# Altium schematic sheet 01.Template.Title.SchDoc
size 209 x 297 mm; Author: Мурашкин Д.В.; DocumentNumber: _D01.R1; SheetNumber: 1; SheetTotal: 2; Scale: 1:1; Letter1Column: Э; PartName: модуль; DocumentsNumber: _D01.R1
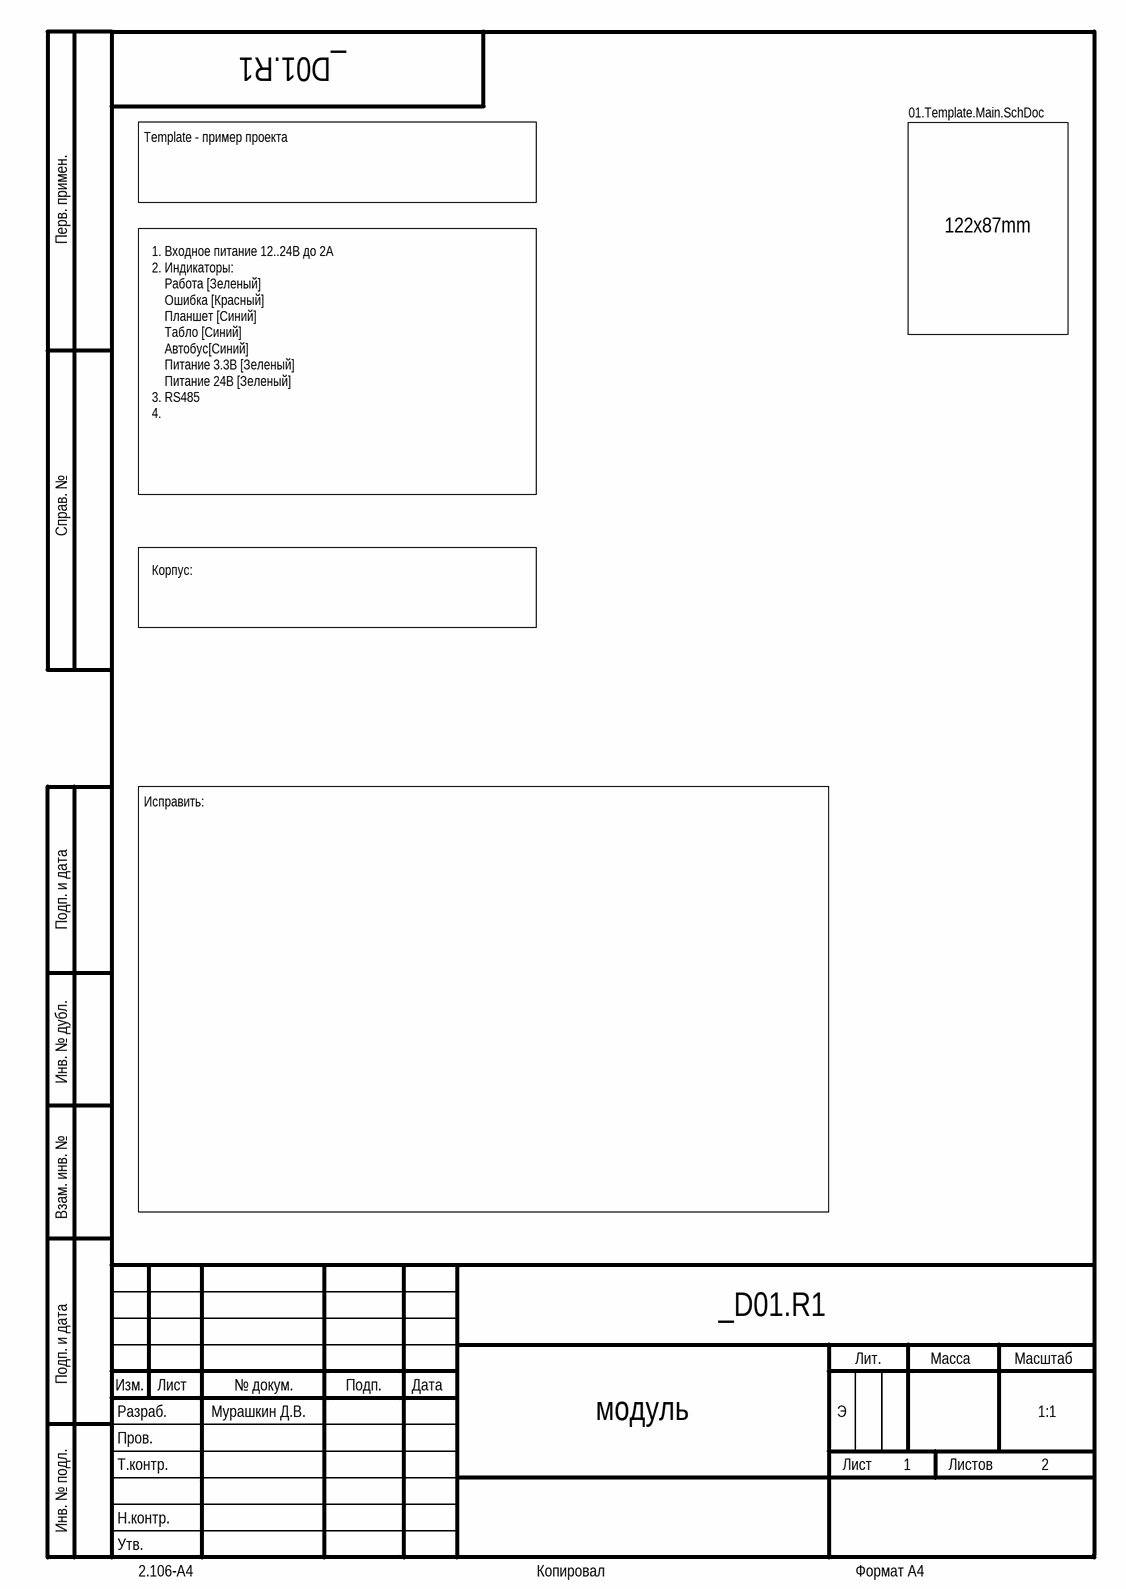
[diagram p0: 01.Template.Title.SchDoc]

## Sub-sheets
01.Template.Main = 01.Template.Main.SchDoc: no entries

## Notes on the sheet
- Template - пример проекта
- 122x87mm
- 1. Входное питание 12..24В до 2А
  2. Индикаторы:
  Работа [Зеленый]
  Ошибка [Красный]
  Планшет [Синий]
  Табло [Синий]
  Автобус[Синий]
  Питание 3.3В [Зеленый]
  Питание 24В [Зеленый]
  3. RS485
  4.
- Корпус:
- Исправить:
- Перв. примен.
- Справ. №
- Подп. и дата
- Инв. № дубл.
- Взам. инв. №
- Разраб.
- Изм.
- Лист
- № докум.
- Подп.
- Дата
- Лит.
- Масса
- Масштаб
- Пров.
- Т.контр.
- Листов
- Инв. № подл.
- Утв.
- Н.контр.
- 2.106-A4
- Копировал
- Формат А4